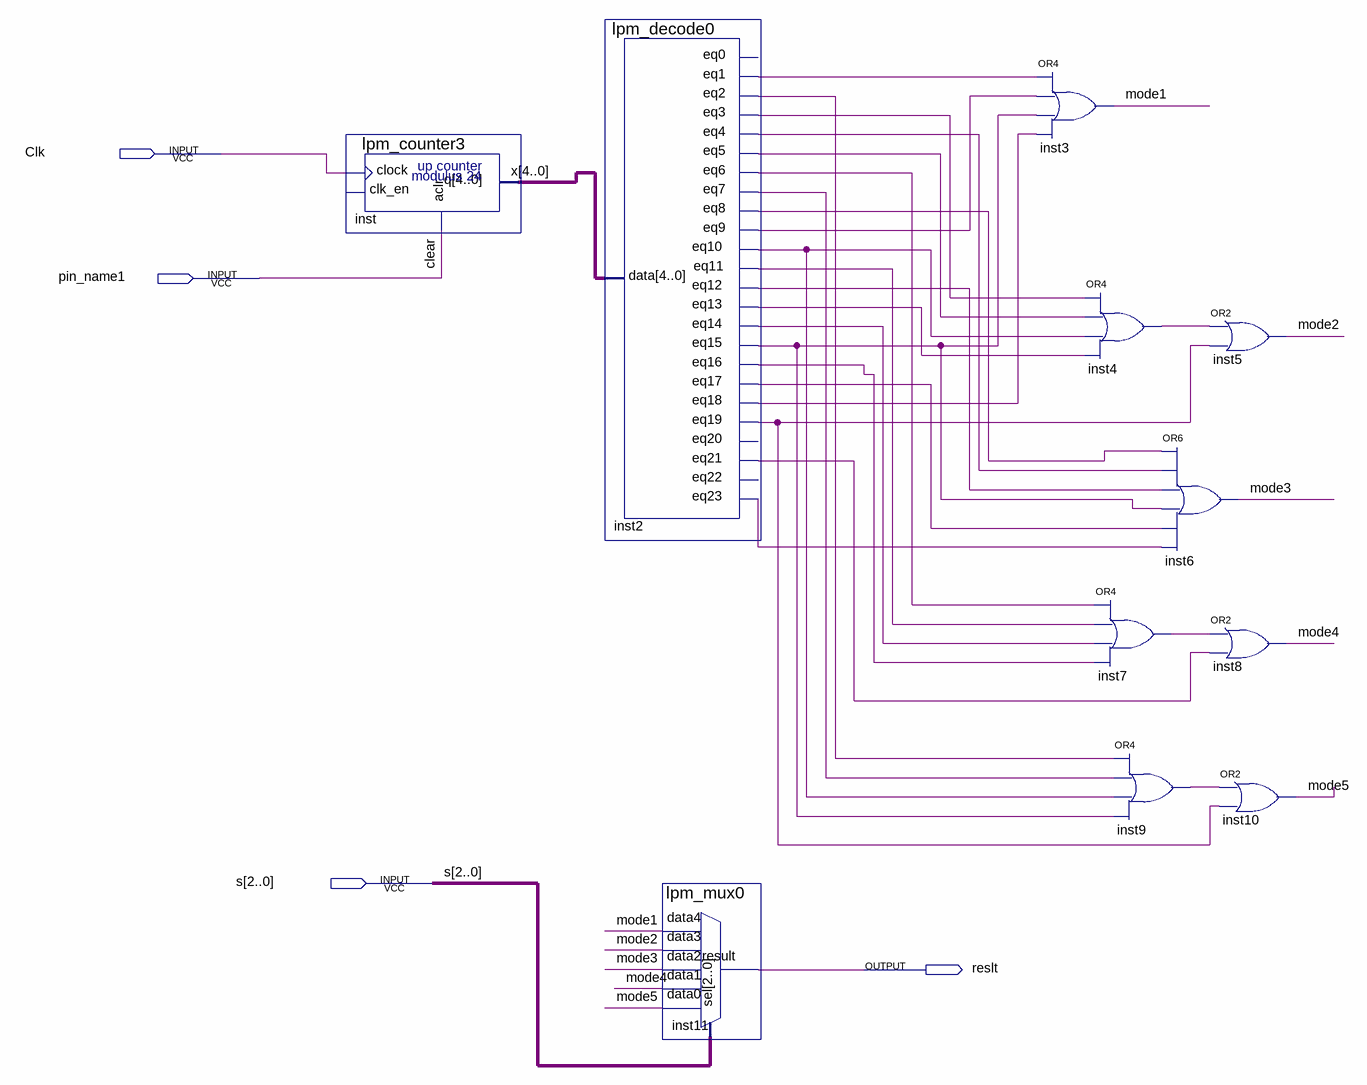
[diagram p0: schematic sheet]
// Quartus schematic cor2.bdf as structural Verilog: 11 symbols, 4 pins
module cor2 (
  input  Clk,
  input  pin_name1,
  input  [2:0] s,
  output reslt
);

  wire inst2_eq1, inst2_eq2, inst2_eq3, inst2_eq4, inst2_eq5, inst2_eq6, inst2_eq7, inst2_eq8, inst2_eq9,
       inst2_eq10, inst2_eq11, inst2_eq12, inst2_eq13, inst2_eq14, inst2_eq15, inst2_eq16, inst2_eq17,
       inst2_eq18, inst2_eq19, inst2_eq21, inst2_eq23, inst4_out, inst7_out, inst9_out, mode1, mode2, mode3,
       mode4, mode5;
  wire [4:0] x;

  lpm_counter3 inst (.clock(Clk), .aclr(pin_name1), .q(x));  // open: clk_en
  lpm_decode0 inst2 (
    .data(x), .eq1(inst2_eq1), .eq2(inst2_eq2), .eq3(inst2_eq3), .eq4(inst2_eq4), .eq5(inst2_eq5),
    .eq6(inst2_eq6), .eq7(inst2_eq7), .eq8(inst2_eq8), .eq9(inst2_eq9), .eq10(inst2_eq10), .eq11(inst2_eq11),
    .eq12(inst2_eq12), .eq13(inst2_eq13), .eq14(inst2_eq14), .eq15(inst2_eq15), .eq16(inst2_eq16),
    .eq17(inst2_eq17), .eq18(inst2_eq18), .eq19(inst2_eq19), .eq21(inst2_eq21), .eq23(inst2_eq23));  // open: eq0, eq20, eq22
  lpm_mux0 inst11 (.data4(mode1), .data3(mode2), .data2(mode3), .data1(mode4), .data0(mode5), .sel(s), .result(reslt));
  or inst3 (mode1, inst2_eq1, inst2_eq9, inst2_eq15, inst2_eq18);
  or inst4 (inst4_out, inst2_eq3, inst2_eq5, inst2_eq10, inst2_eq13);
  or inst6 (mode3, inst2_eq8, inst2_eq4, inst2_eq12, inst2_eq15, inst2_eq17, inst2_eq23);
  or inst7 (inst7_out, inst2_eq6, inst2_eq11, inst2_eq14, inst2_eq16);
  or inst9 (inst9_out, inst2_eq2, inst2_eq7, inst2_eq10, inst2_eq15);
  or inst5 (mode2, inst4_out, inst2_eq19);
  or inst8 (mode4, inst7_out, inst2_eq21);
  or inst10 (mode5, inst9_out, inst2_eq19);

  // Other names for the same wires on the sheet: clear = pin_name1
endmodule
